# EAGLE schematic Christmas-Snow-Globe v21 (EAGLE 9.7.0)

## Sheet 1 of 2
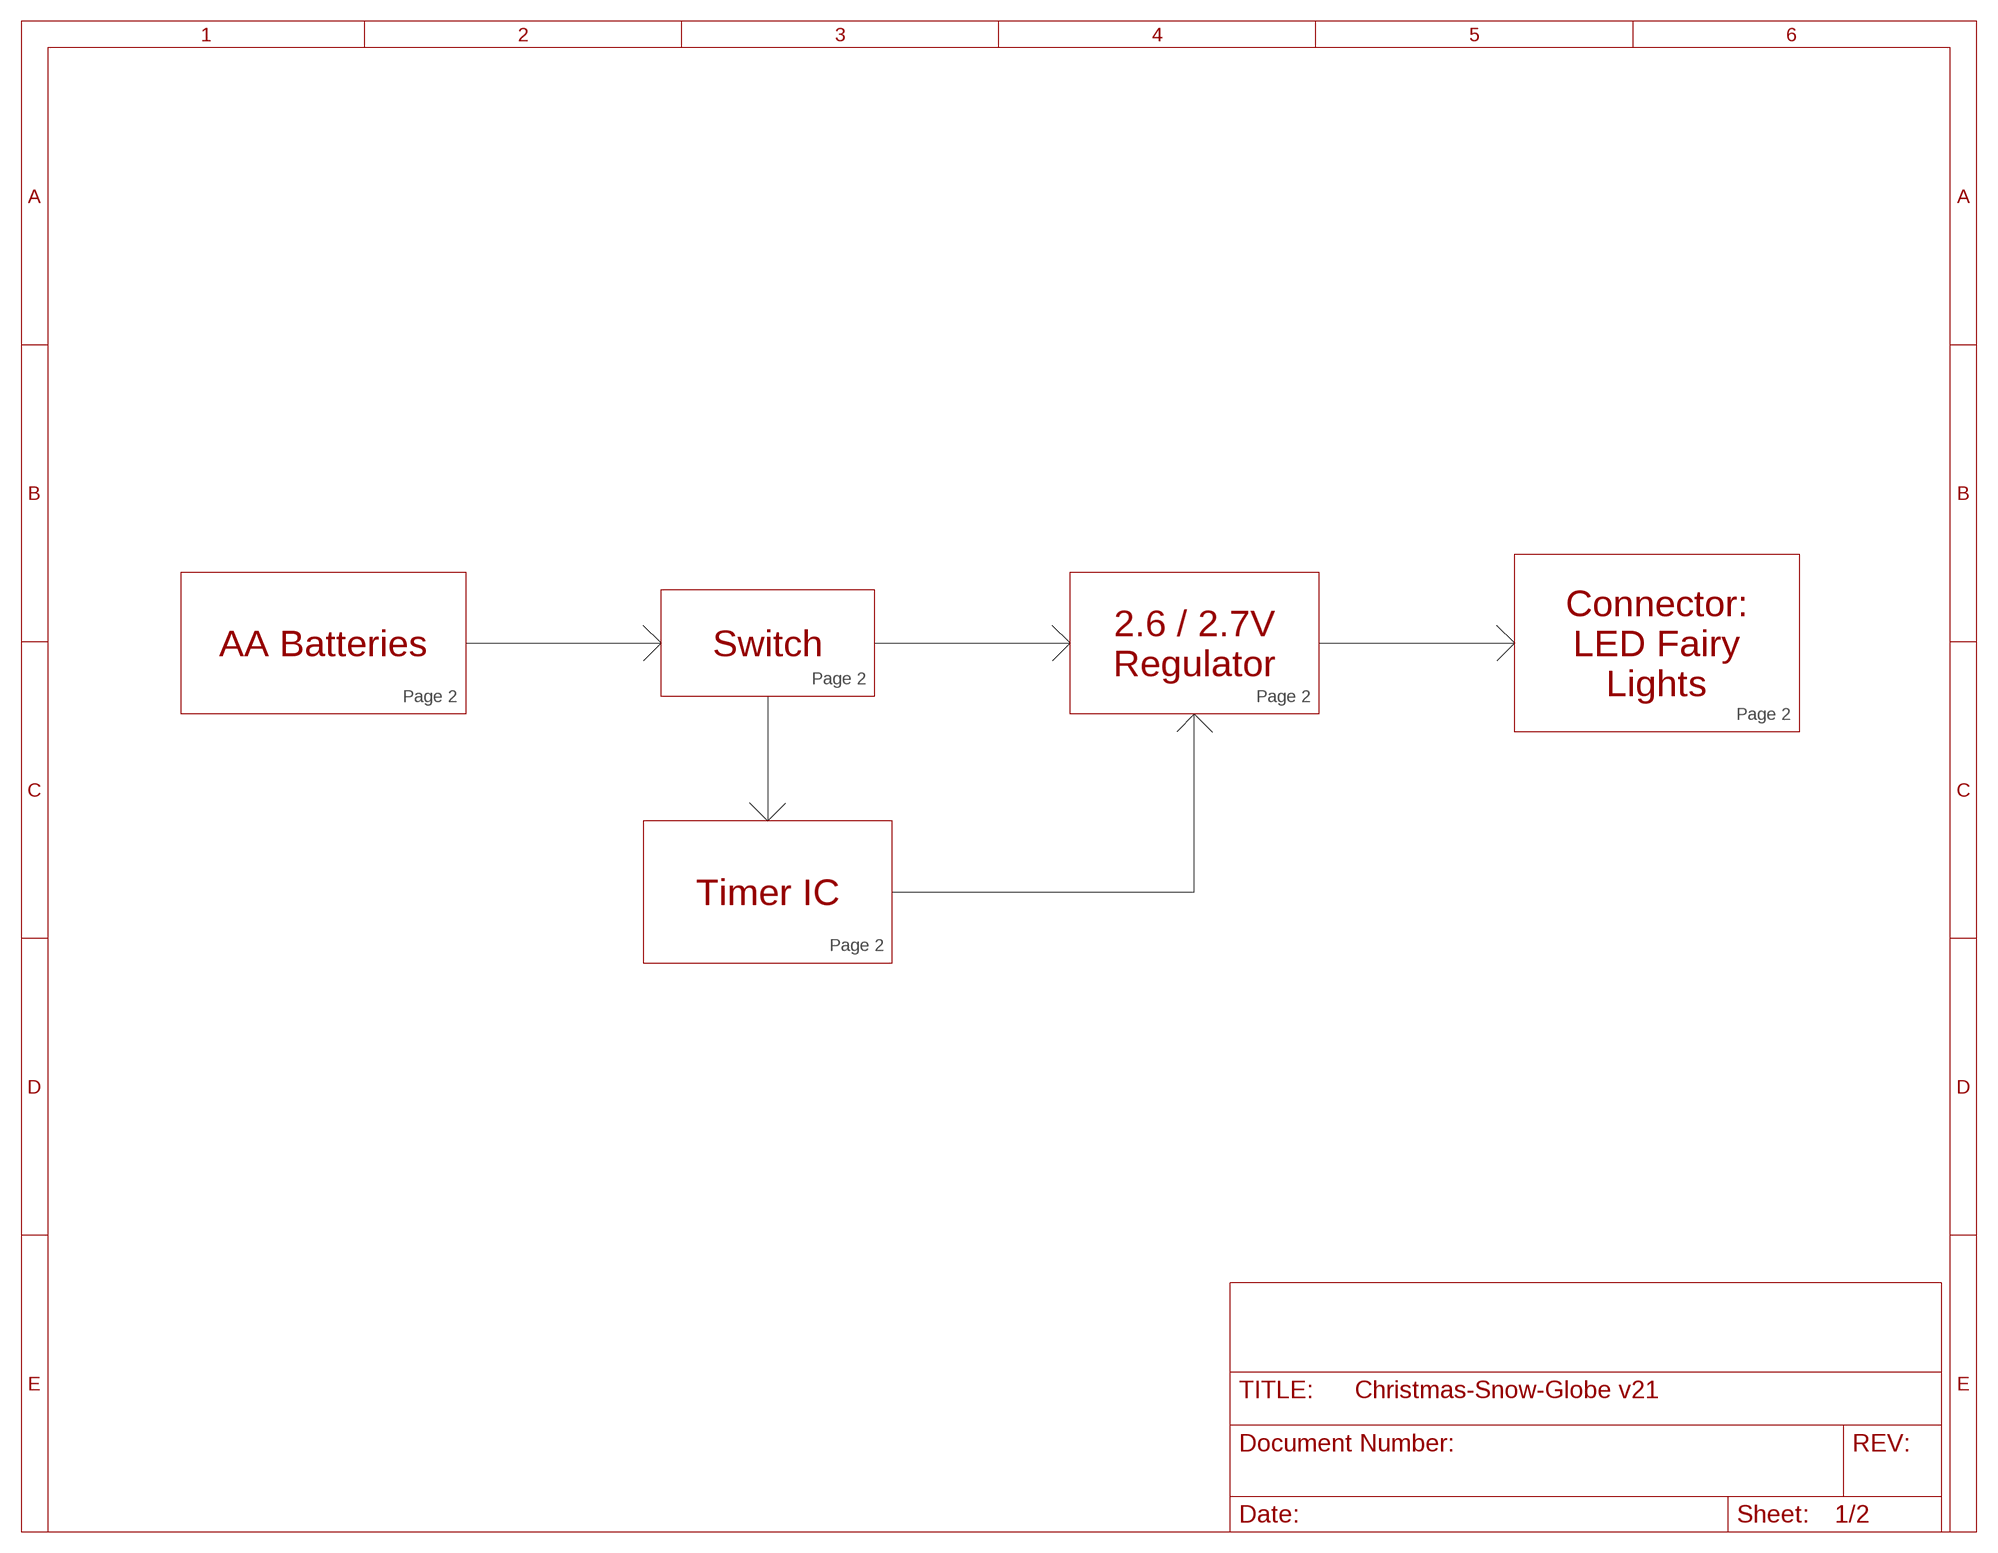
[diagram p0: schematic, sheet 1]

### Notes on the sheet
- AA Batteries | Switch
- 2.6 / 2.7V
  Regulator
- Connector:
  LED Fairy
  Lights
- Page 2
- Page 2 | Page 2
- Page 2
- Timer IC
- Page 2

## Sheet 2 of 2
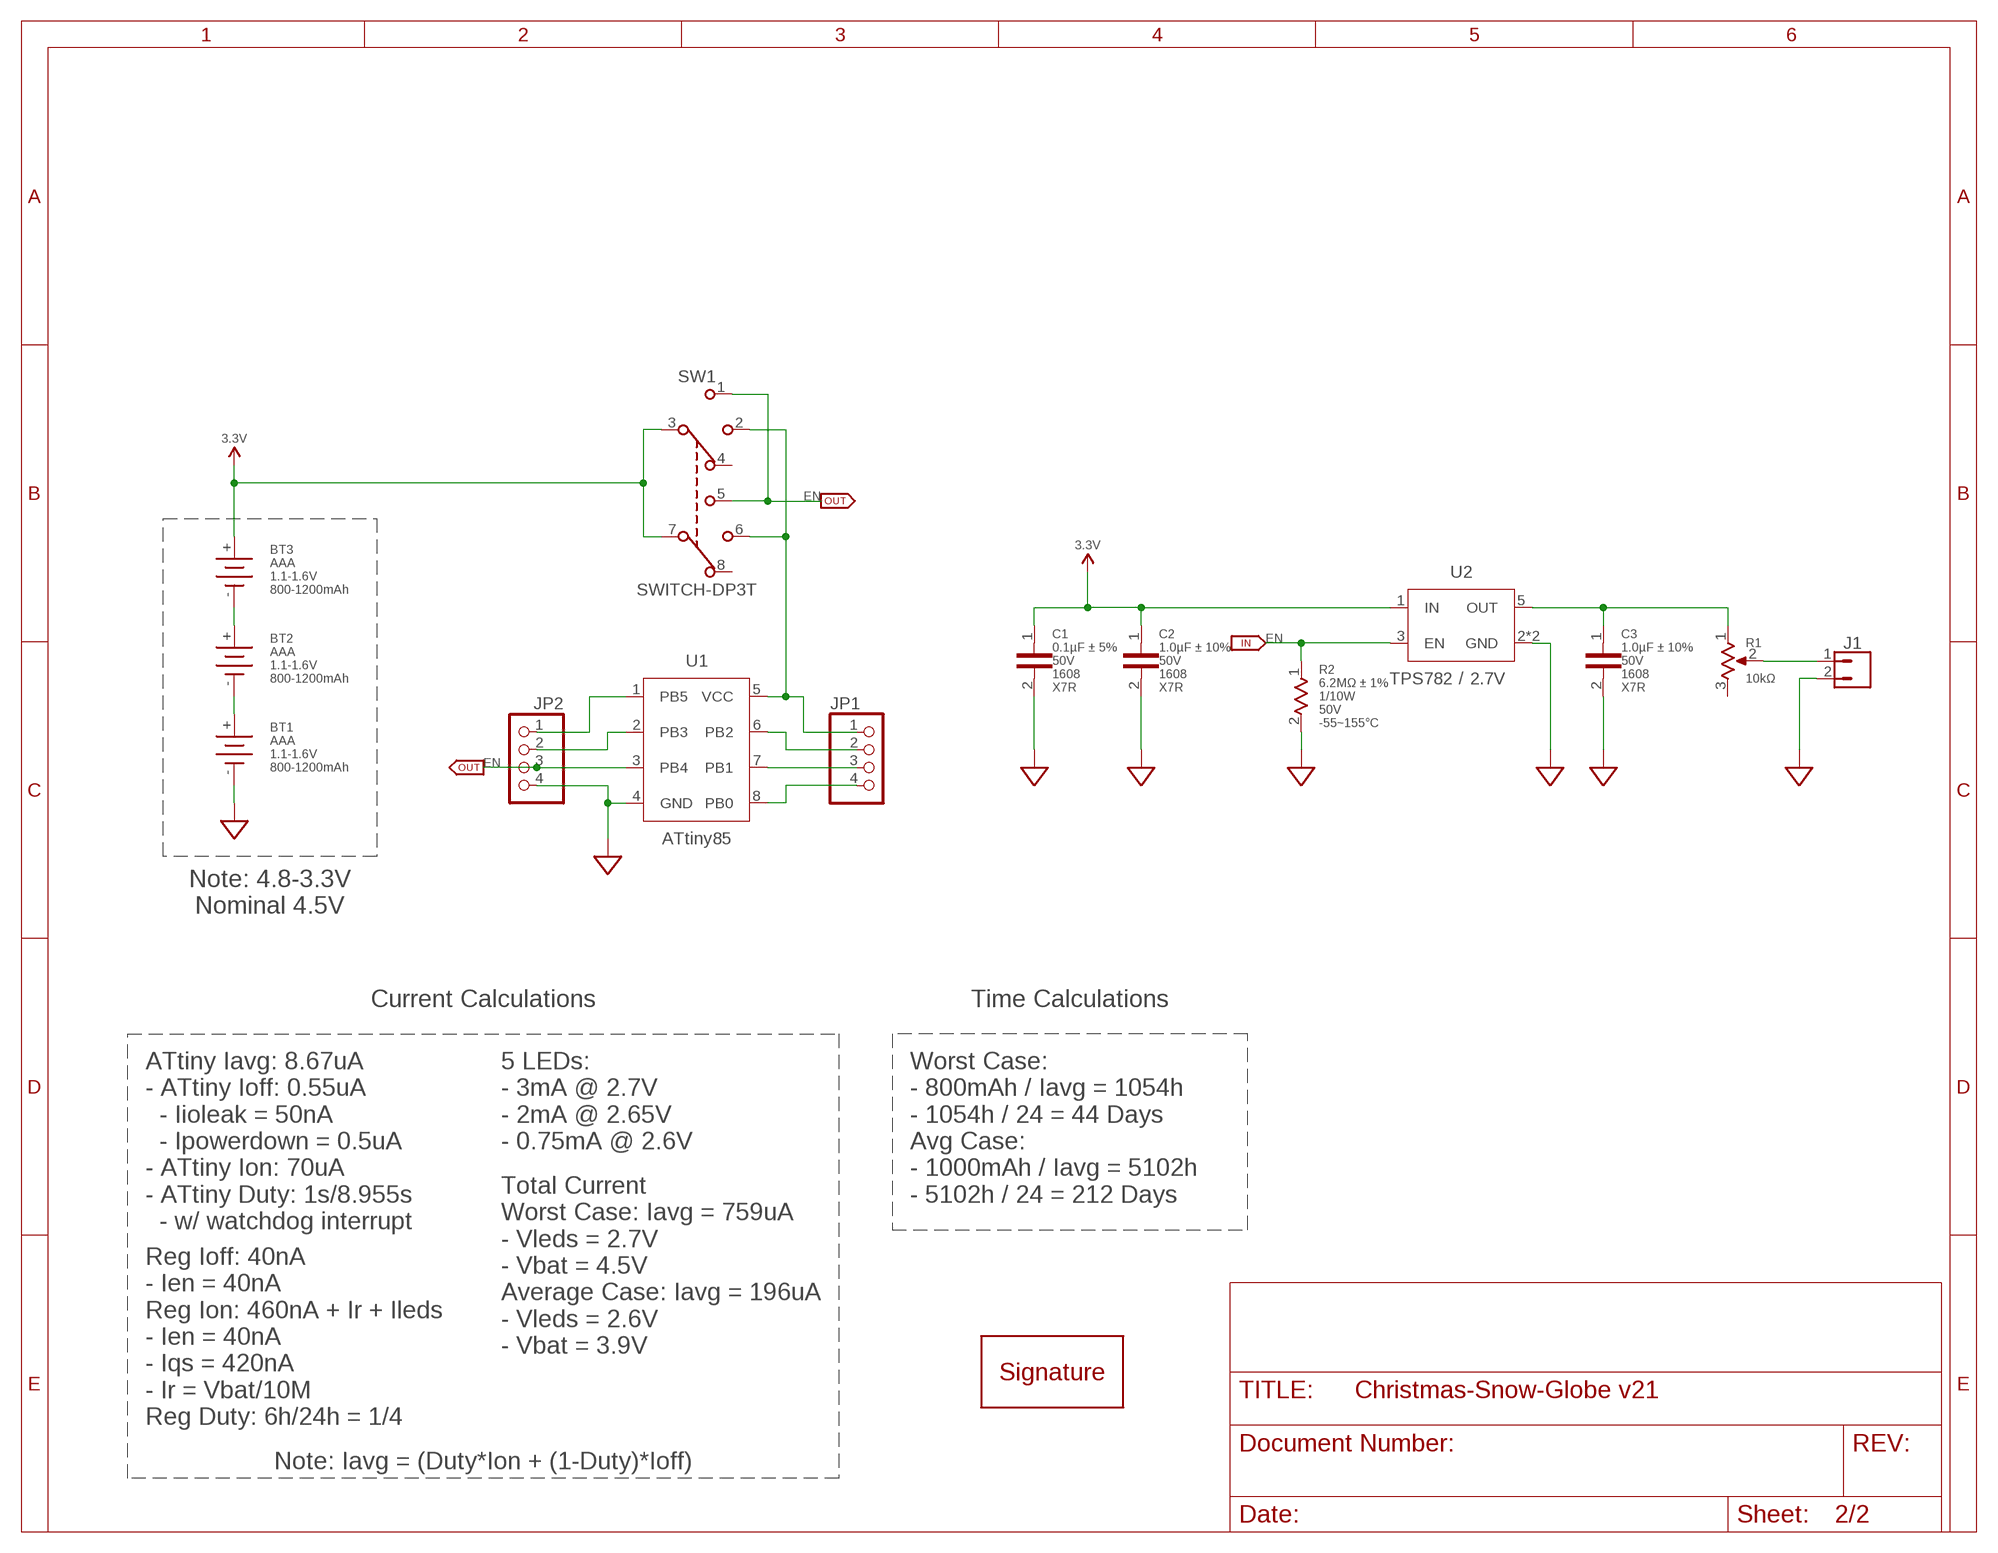
[diagram p1: schematic, sheet 2]

### Parts
BT1  AAA  BATTERYAAA-AAA  [AAA-CONTACTS]
BT2  AAA  BATTERYAAA-AAA  [AAA-CONTACTS]
BT3  AAA  BATTERYAAA-AAA  [AAA-CONTACTS]
C1  0.1µF ± 5%  CAP-V-0.1UF-1608  [1608-SEM]
C2  1.0µF ± 10%  CAP-V-1.0UF-1608  [1608-SEM]
C3  1.0µF ± 10%  CAP-V-1.0UF-1608  [1608-SEM]
J1  JST-PH-2  [B2B-PH-K-S]
JP1  PINHD-1X4  [1X04]
JP2  PINHD-1X4  [1X04]
R1  10kΩ  TRIMPOT-V-10K  [3314J]
R2  6.2MΩ ± 1%  RES-V-6.2M-1608  [1608-SEM]
SW1  SWITCH-DP3T  [EG2301]
U1  ATtiny85  ATTINNY85  [8P3-PDIP]
U2  TPS782  TPS78X-2.7V  [SOT-23-5]
U$14  SIGNATURE  [SIGNATURE]

### Nets
3.3V: BT3.+ C1.1 C2.1 SW1.3 SW1.7 U2.1(IN)
EN: JP2.3 R2.1 SW1.1 SW1.5 U1.3(PB4) U2.3(EN)
GND: BT1.- C1.2 C2.2 C3.2 J1.2 JP2.4 R2.2 U1.4(GND) U2.2(GND) U2.4(GND)
LEDS+: J1.1 R1.2
N$1: BT2.+ BT3.-
N$2: BT1.+ BT2.-
PB0: JP1.4 U1.8(PB0)
PB1: JP1.3 U1.7(PB1)
PB2: JP1.2 U1.6(PB2)
PB3: JP2.2 U1.2(PB3)
PB5: JP2.1 U1.1(PB5)
TIMER: JP1.1 SW1.2 SW1.6 U1.5(VCC)
TPS782_OUT: C3.1 R1.1 U2.5(OUT)
Unconnected: R1.3 SW1.4 SW1.8

### Notes on the sheet
- Note: 4.8-3.3V
  Nominal 4.5V
- Current Calculations | Time Calculations
- ATtiny Iavg: 8.67uA
  - ATtiny Ioff: 0.55uA
    - Iioleak = 50nA
    - Ipowerdown = 0.5uA
  - ATtiny Ion: 70uA
  - ATtiny Duty: 1s/8.955s 
    - w/ watchdog interrupt
- 5 LEDs:
  - 3mA @ 2.7V
  - 2mA @ 2.65V
  - 0.75mA @ 2.6V
- Worst Case: 
  - 800mAh / Iavg = 1054h
  - 1054h / 24 = 44 Days
  Avg Case:
  - 1000mAh / Iavg = 5102h
  - 5102h / 24 = 212 Days
- Total Current
  Worst Case: Iavg = 759uA
  - Vleds = 2.7V
  - Vbat = 4.5V
  Average Case: Iavg = 196uA  
  - Vleds = 2.6V
  - Vbat = 3.9V
- Reg Ioff: 40nA
  - Ien = 40nA
  Reg Ion: 460nA + Ir + Ileds
  - Ien = 40nA
  - Iqs = 420nA 
  - Ir = Vbat/10M
  Reg Duty: 6h/24h = 1/4
- Note: Iavg = (Duty*Ion + (1-Duty)*Ioff)

## Library data of the parts
BT1-BT3 = Harrington-Energy:BATTERY: Batteries; CAPACITY: 800-1200mAh; VOLTAGE: 1.1-1.6V
C1-C3 = Harrington-Capacitors:CAP-V: Ceramic Capacitors - Vertical; SIZE: 1608; TEMPERATURE: X7R; VOLTAGE: 50V
J1 = Harrington-Connectors:JST-PH-2: 2-pin PH Connector JST - Max Voltage: 100V - Max Current: 2A
JP1 JP2 = pinhead:PINHD-1X4: PIN HEADER
R1 = Harrington-Resistors:TRIMPOT-V: Trimming Potentiometers Bourns - Vertical
R2 = Harrington-Resistors:RES-V: Resistors - Vertical; POWER: 1/10W; TEMPERATURE: -55~155°C; VOLTAGE: 50V
SW1 = Harrington-Switches:SWITCH-DP3T: DP3T Switch E-Switch
U1 = Harrington-ICs:ATTINNY85
U2 = Harrington-ICs:TPS78X: TPS782/TPS783 Low Quiescent Current Voltage Regulator Texas Instruments - Output capacitors may differ - Each part has different fixed voltage options; VOLTAGE: 2.7V
U$14 = Harrington-Aesthetics:SIGNATURE: PCB Signature